# EAGLE schematic Concept_1.0_DRAFT (EAGLE 9.3.2)
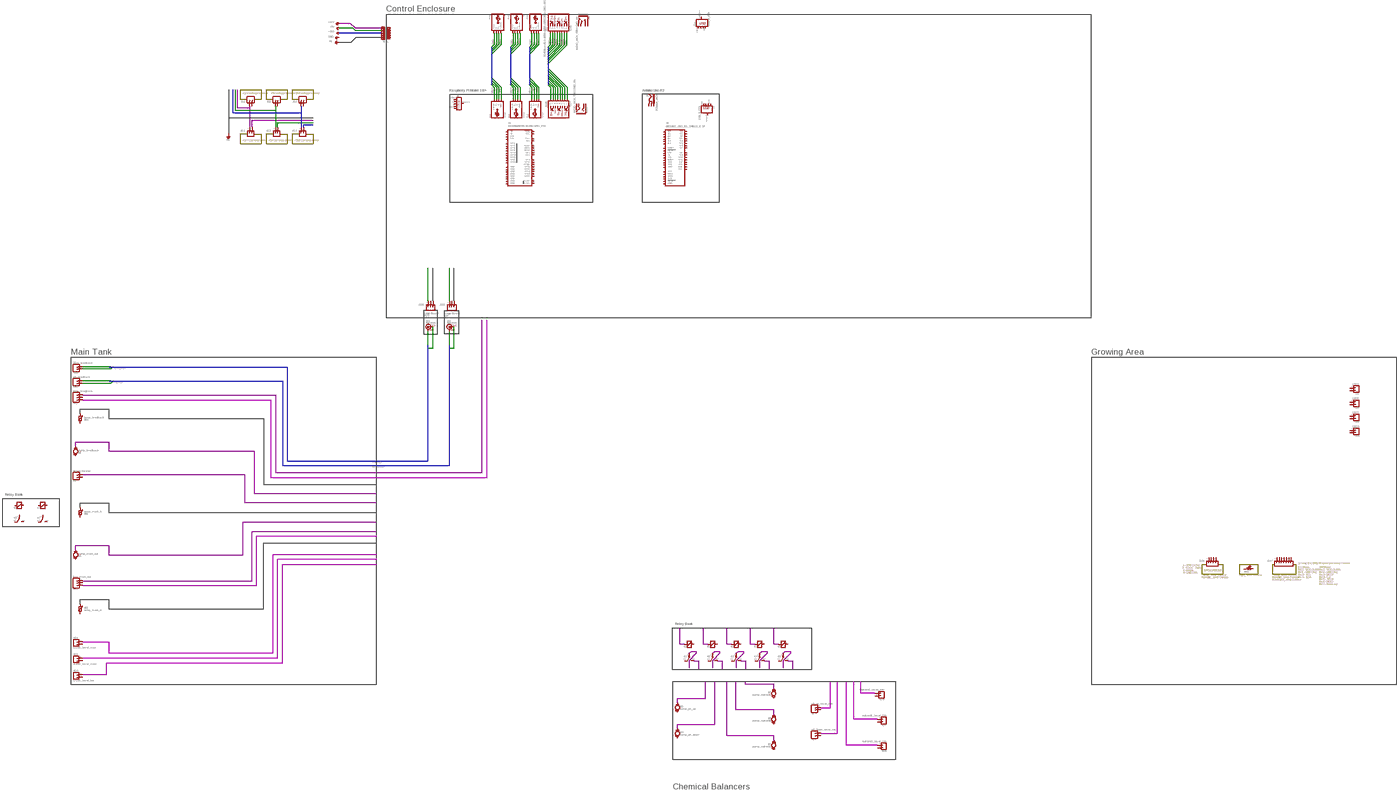
[diagram p0: schematic, sheet 1, overview]
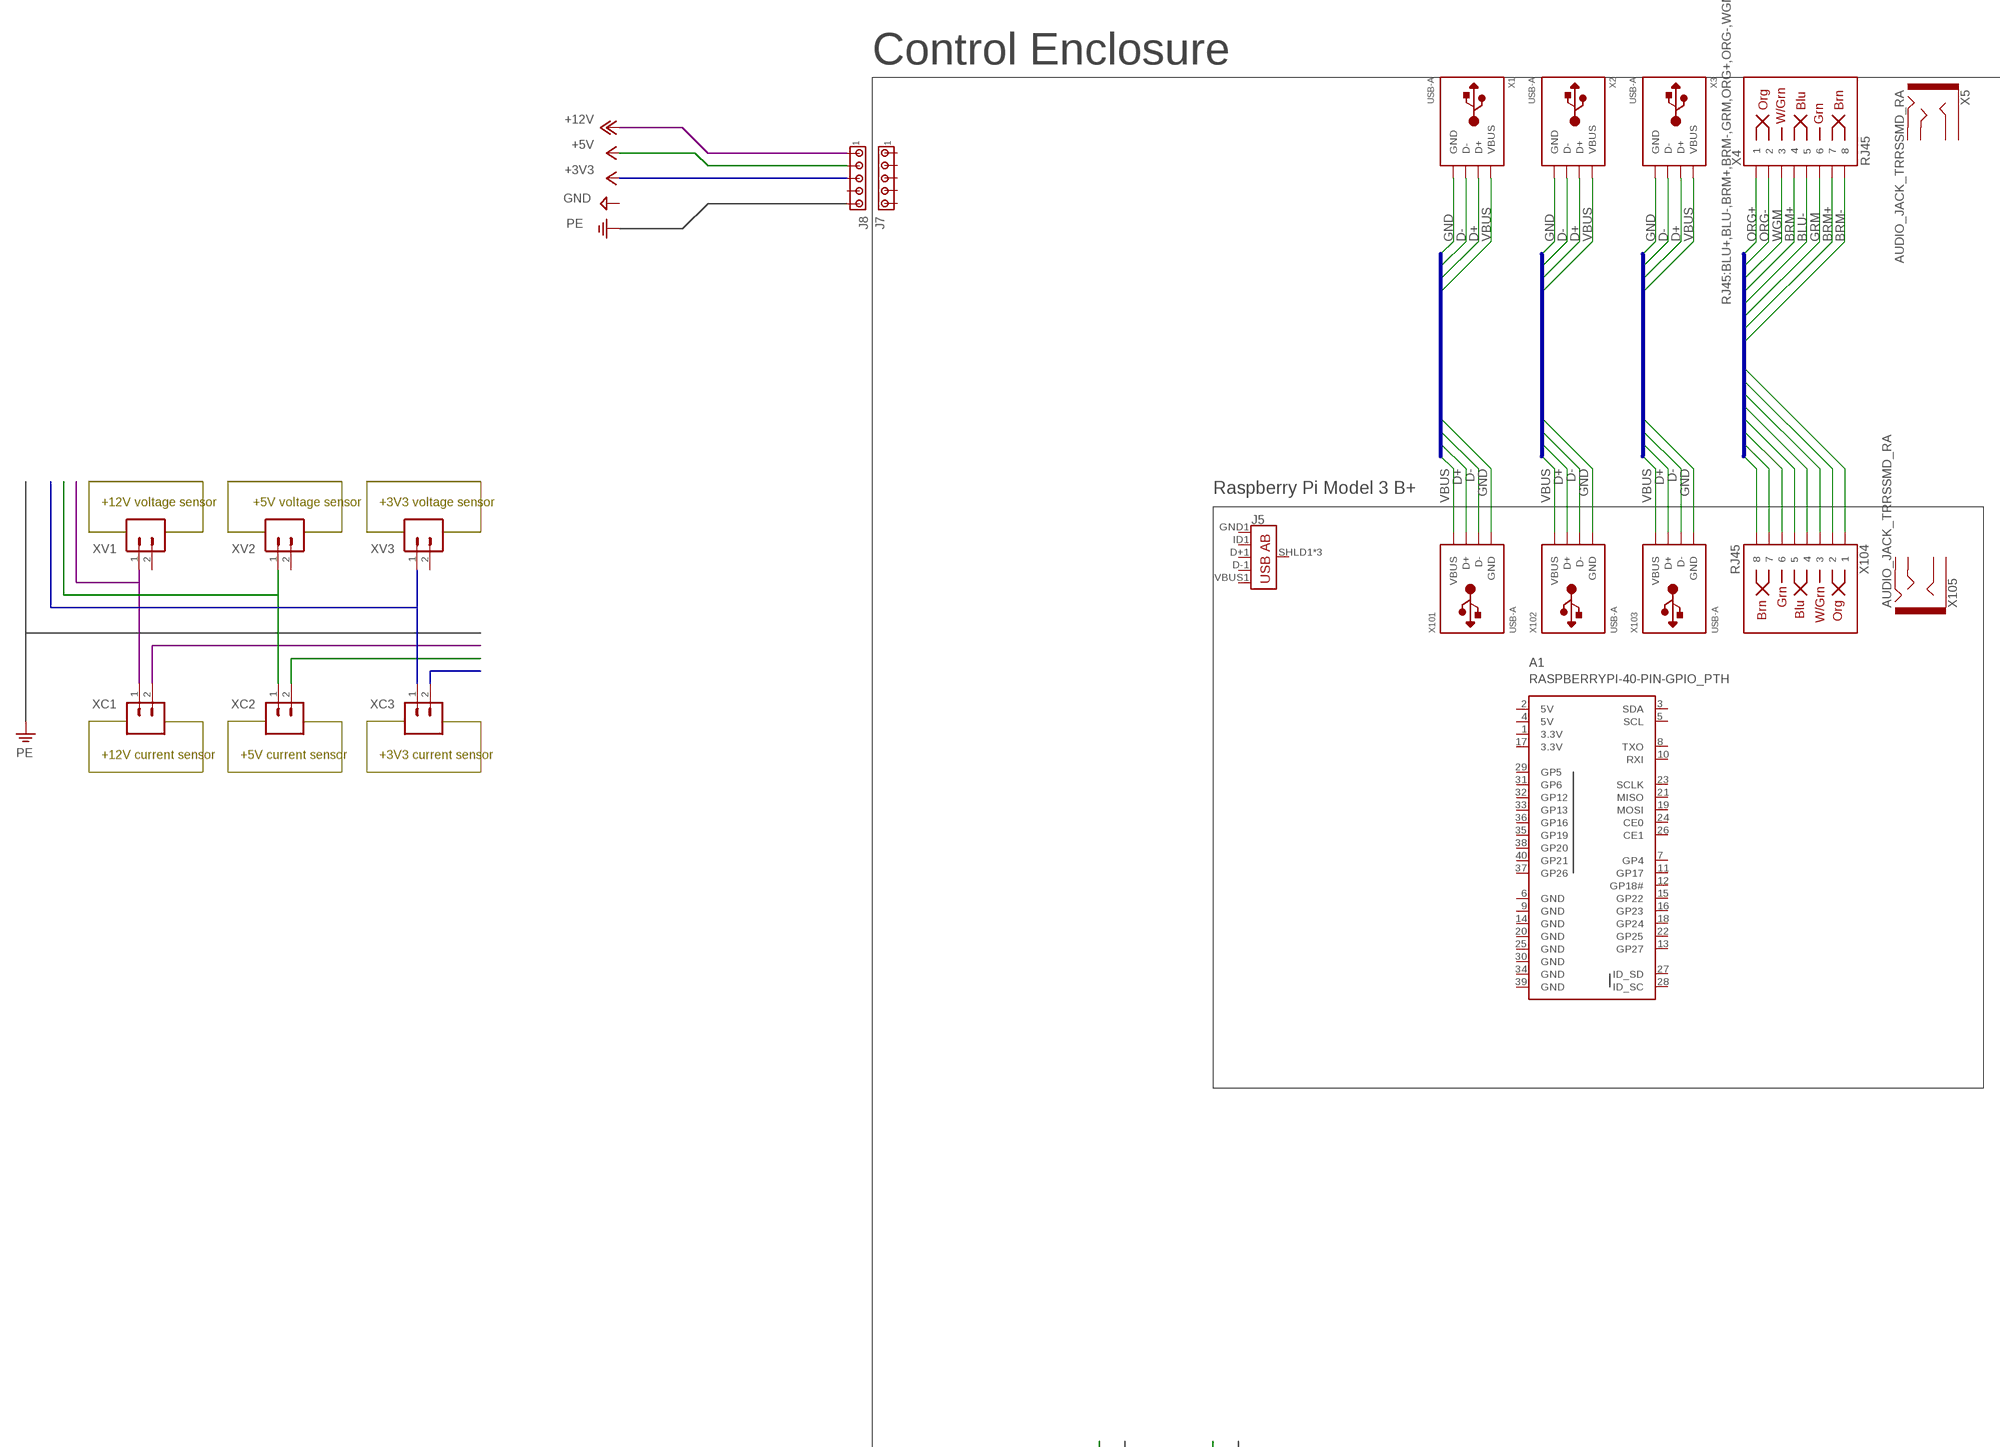
[diagram p1: schematic, sheet 1, part 1 of 7]
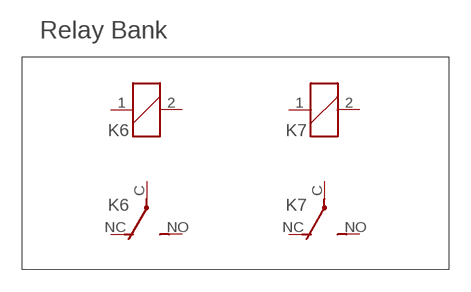
[diagram p2: schematic, sheet 1, part 2 of 7]
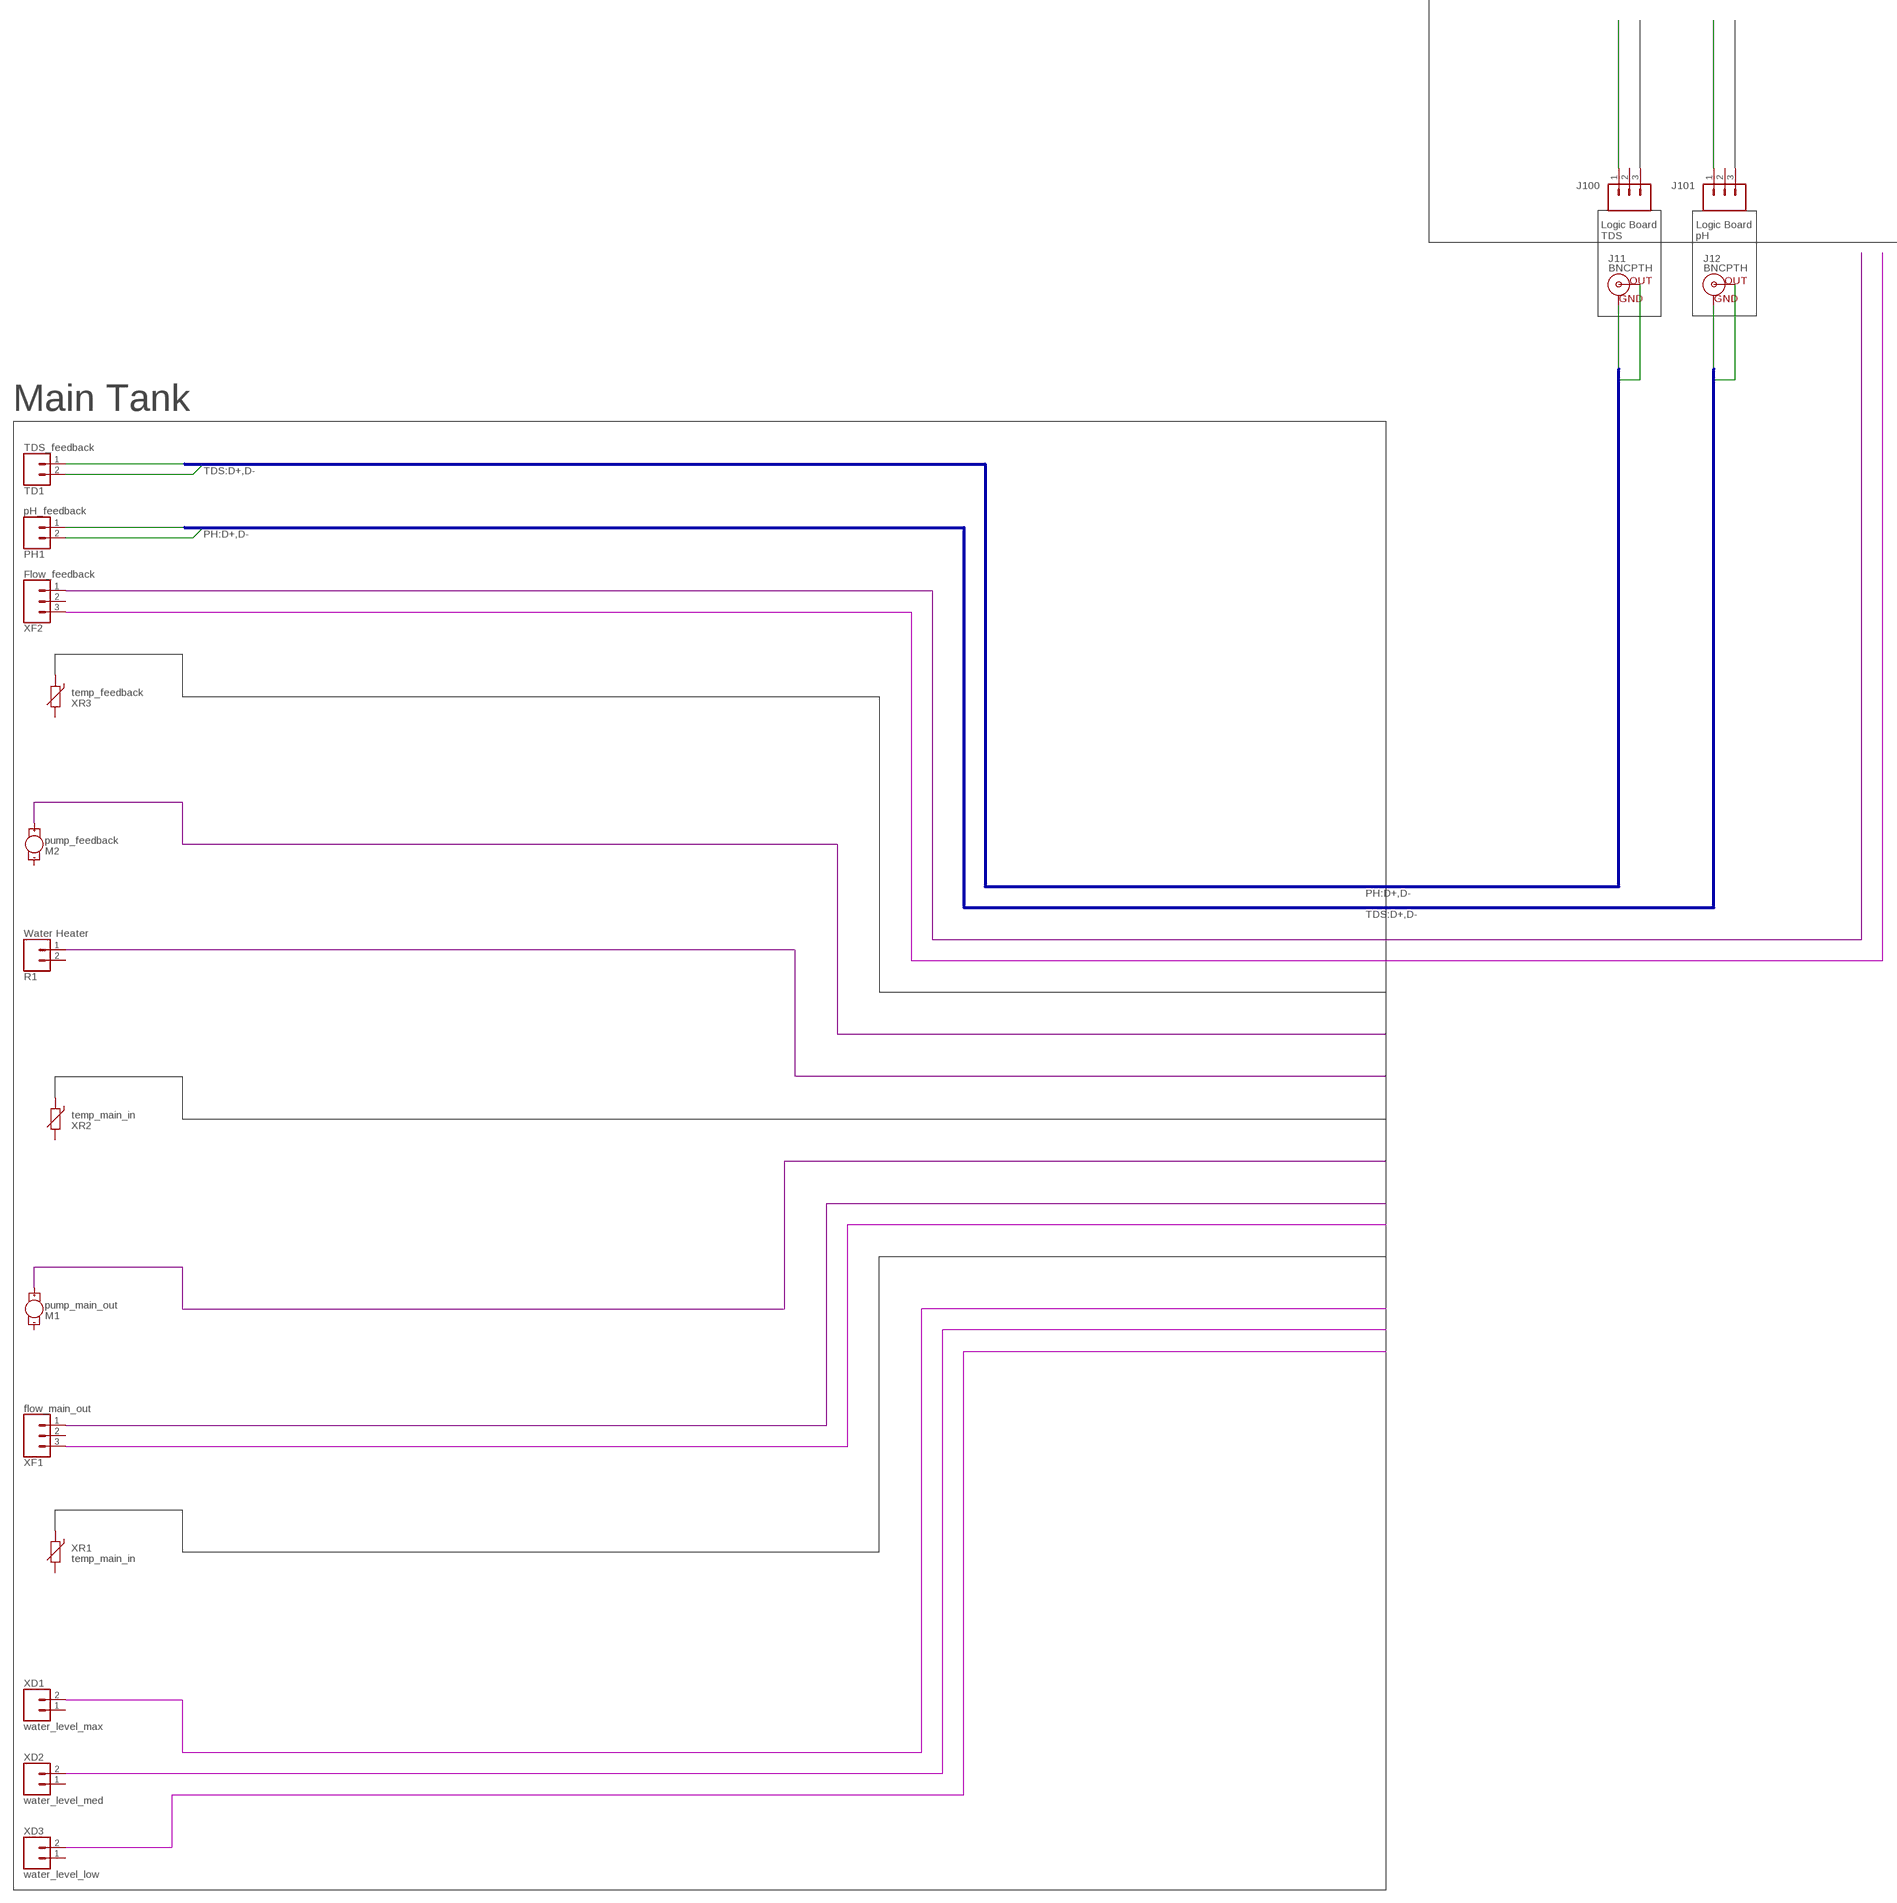
[diagram p3: schematic, sheet 1, part 3 of 7]
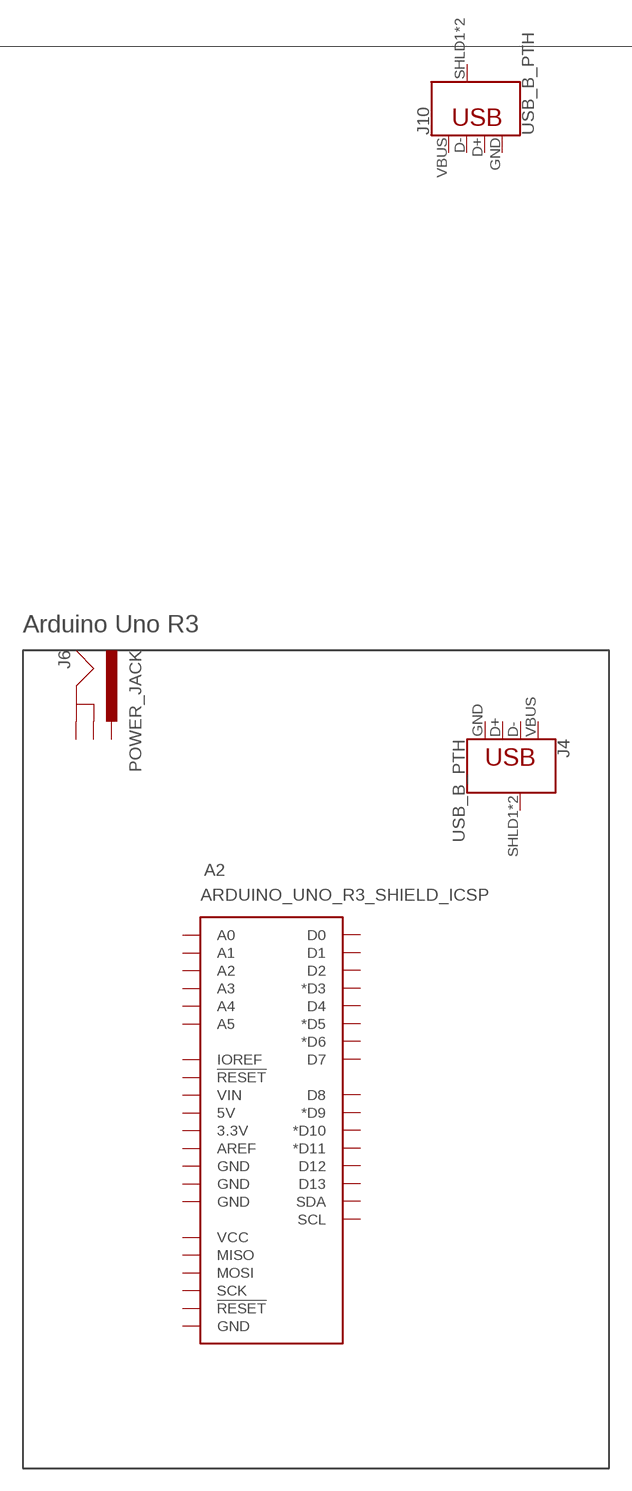
[diagram p4: schematic, sheet 1, part 4 of 7]
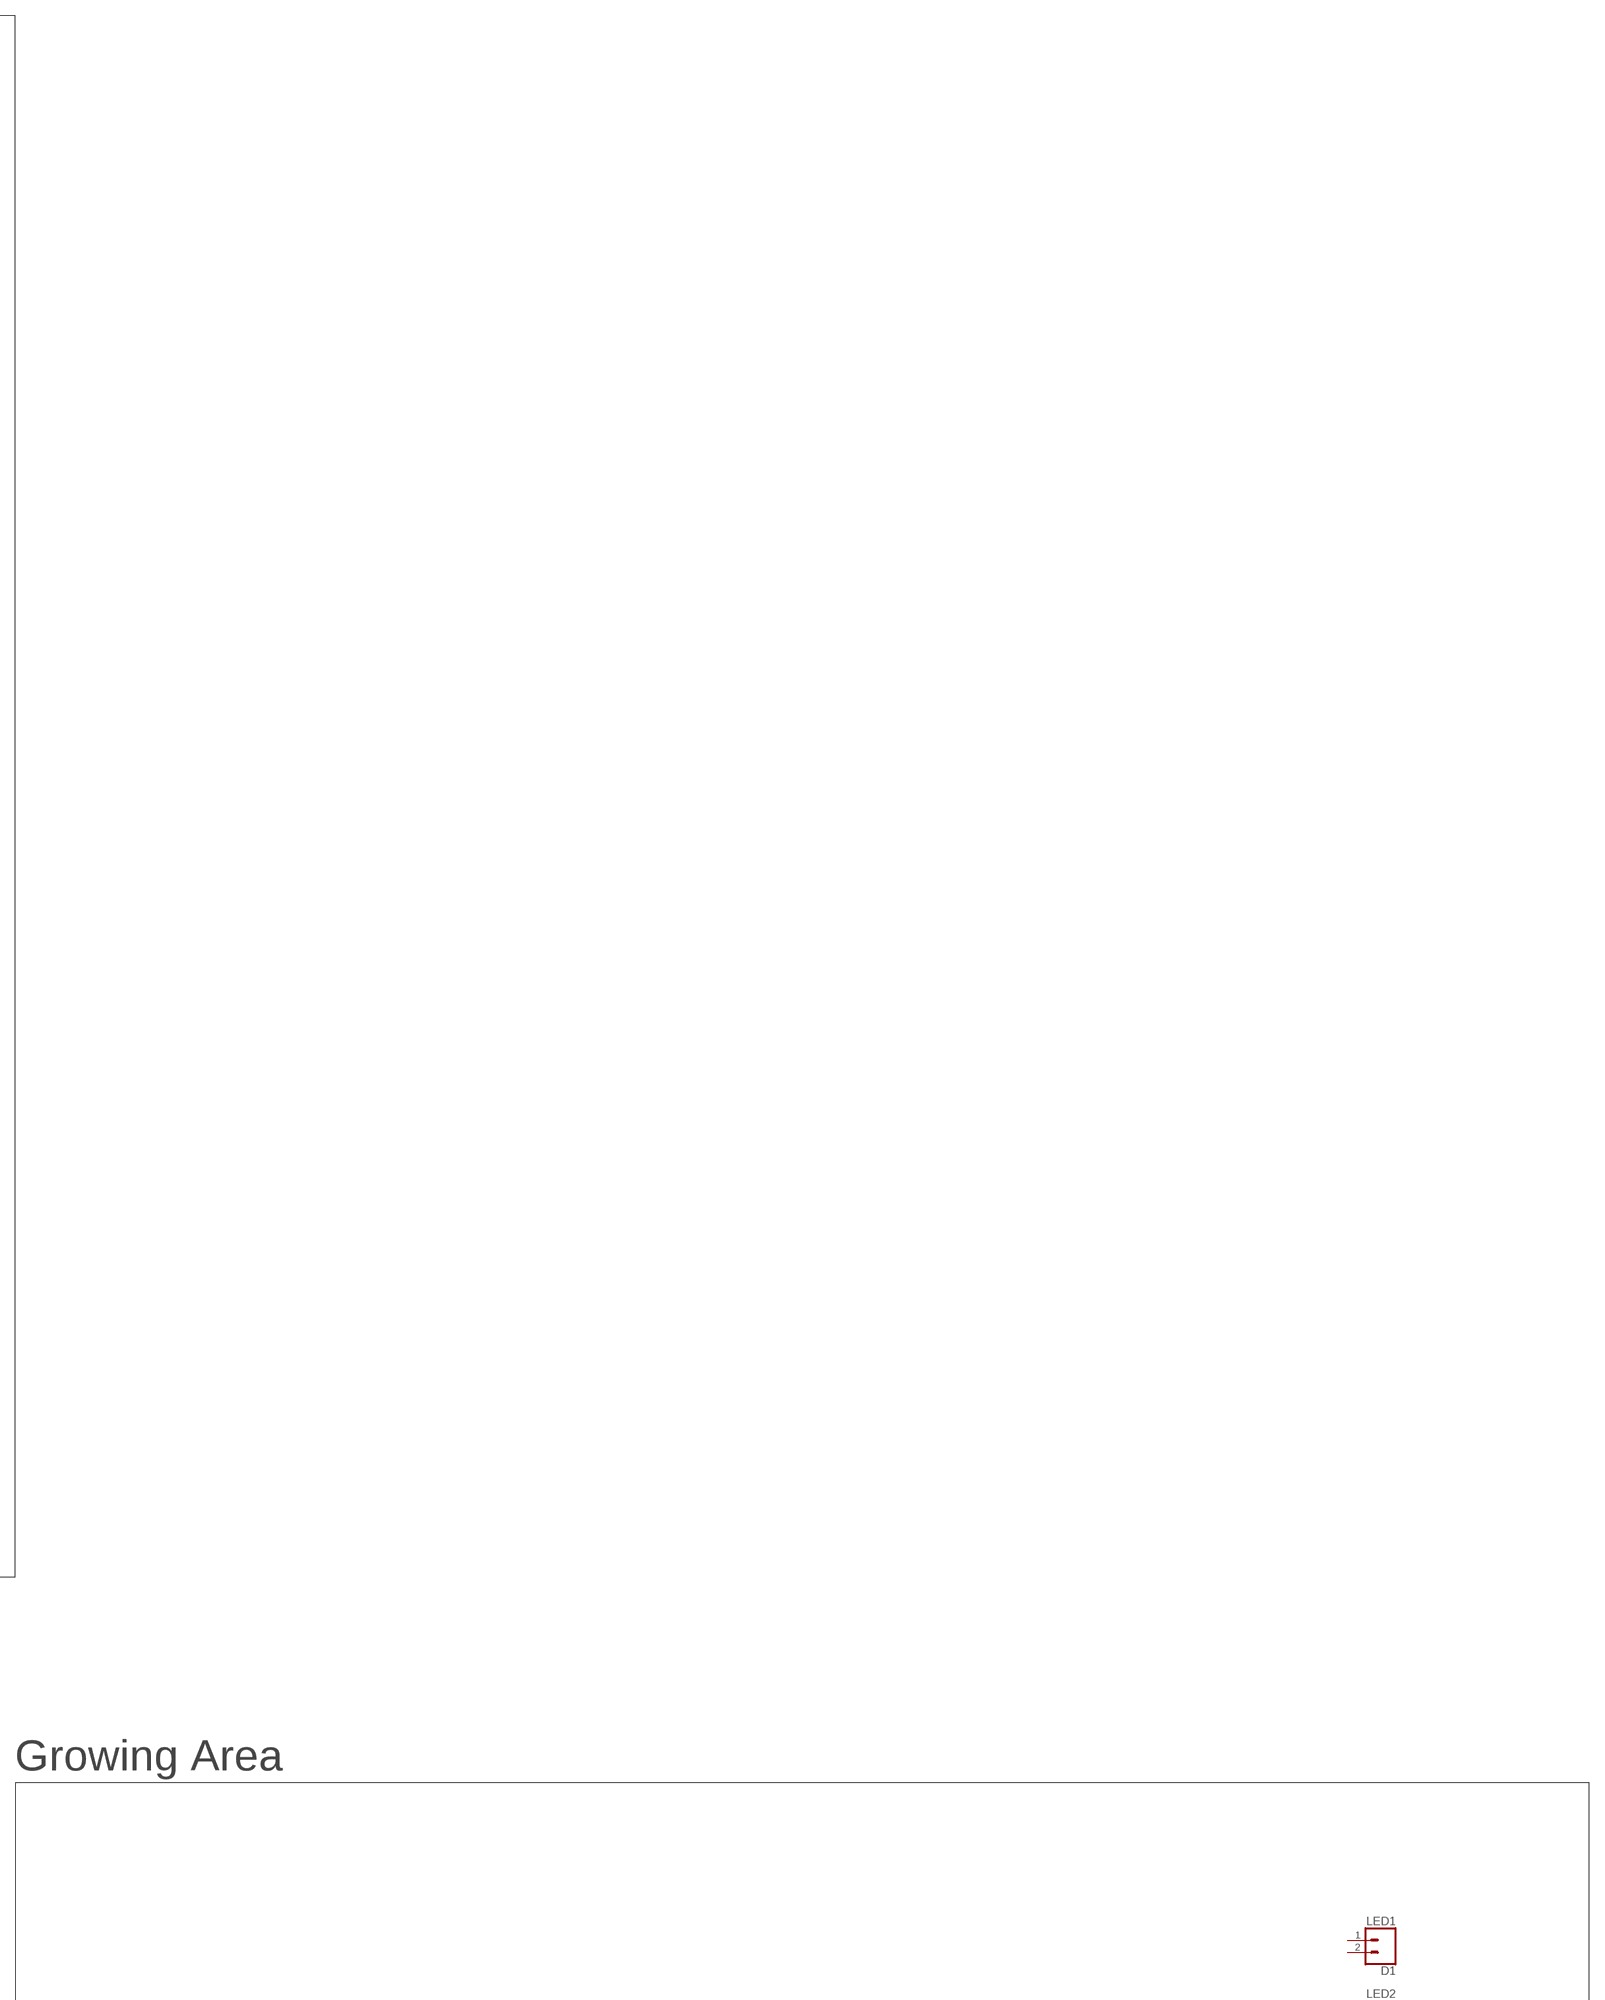
[diagram p5: schematic, sheet 1, part 5 of 7]
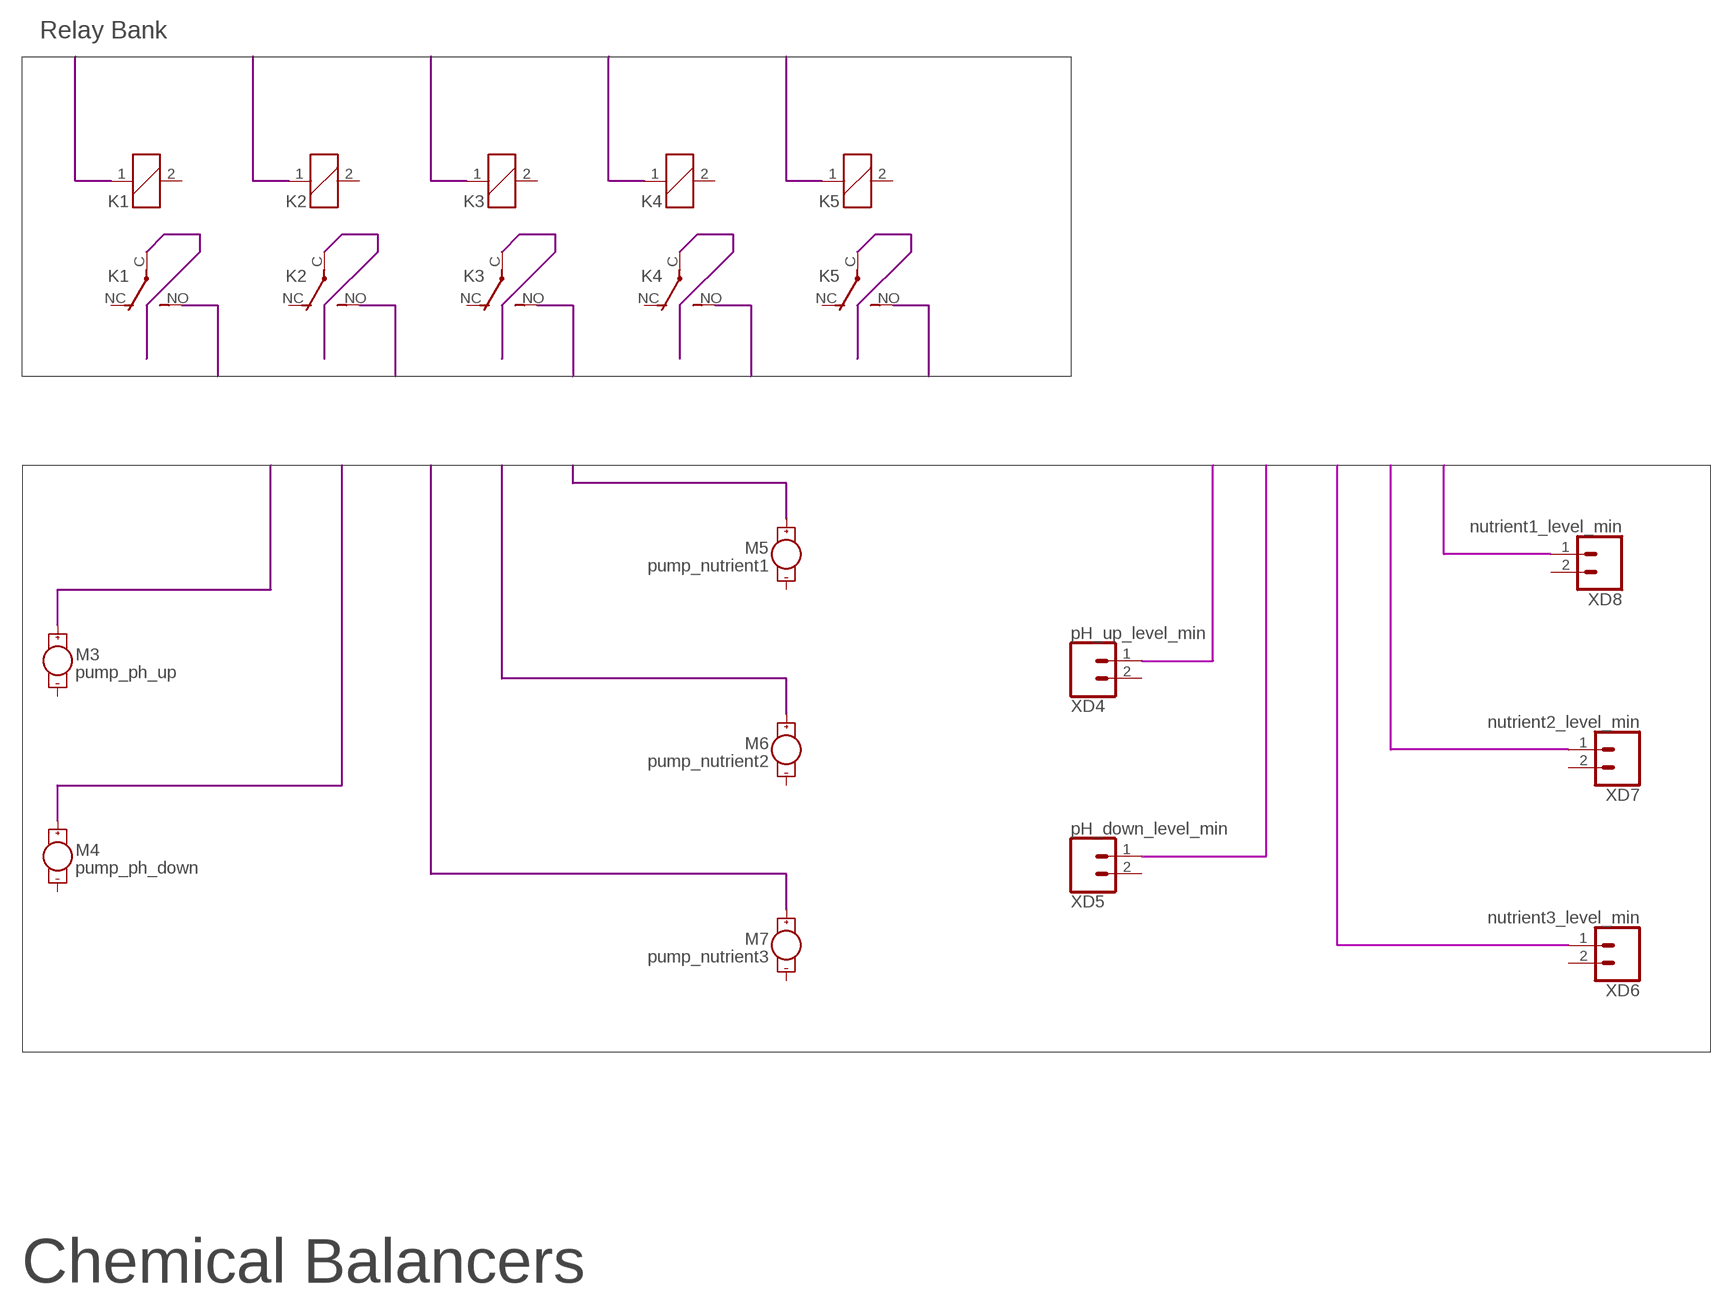
[diagram p6: schematic, sheet 1, part 6 of 7]
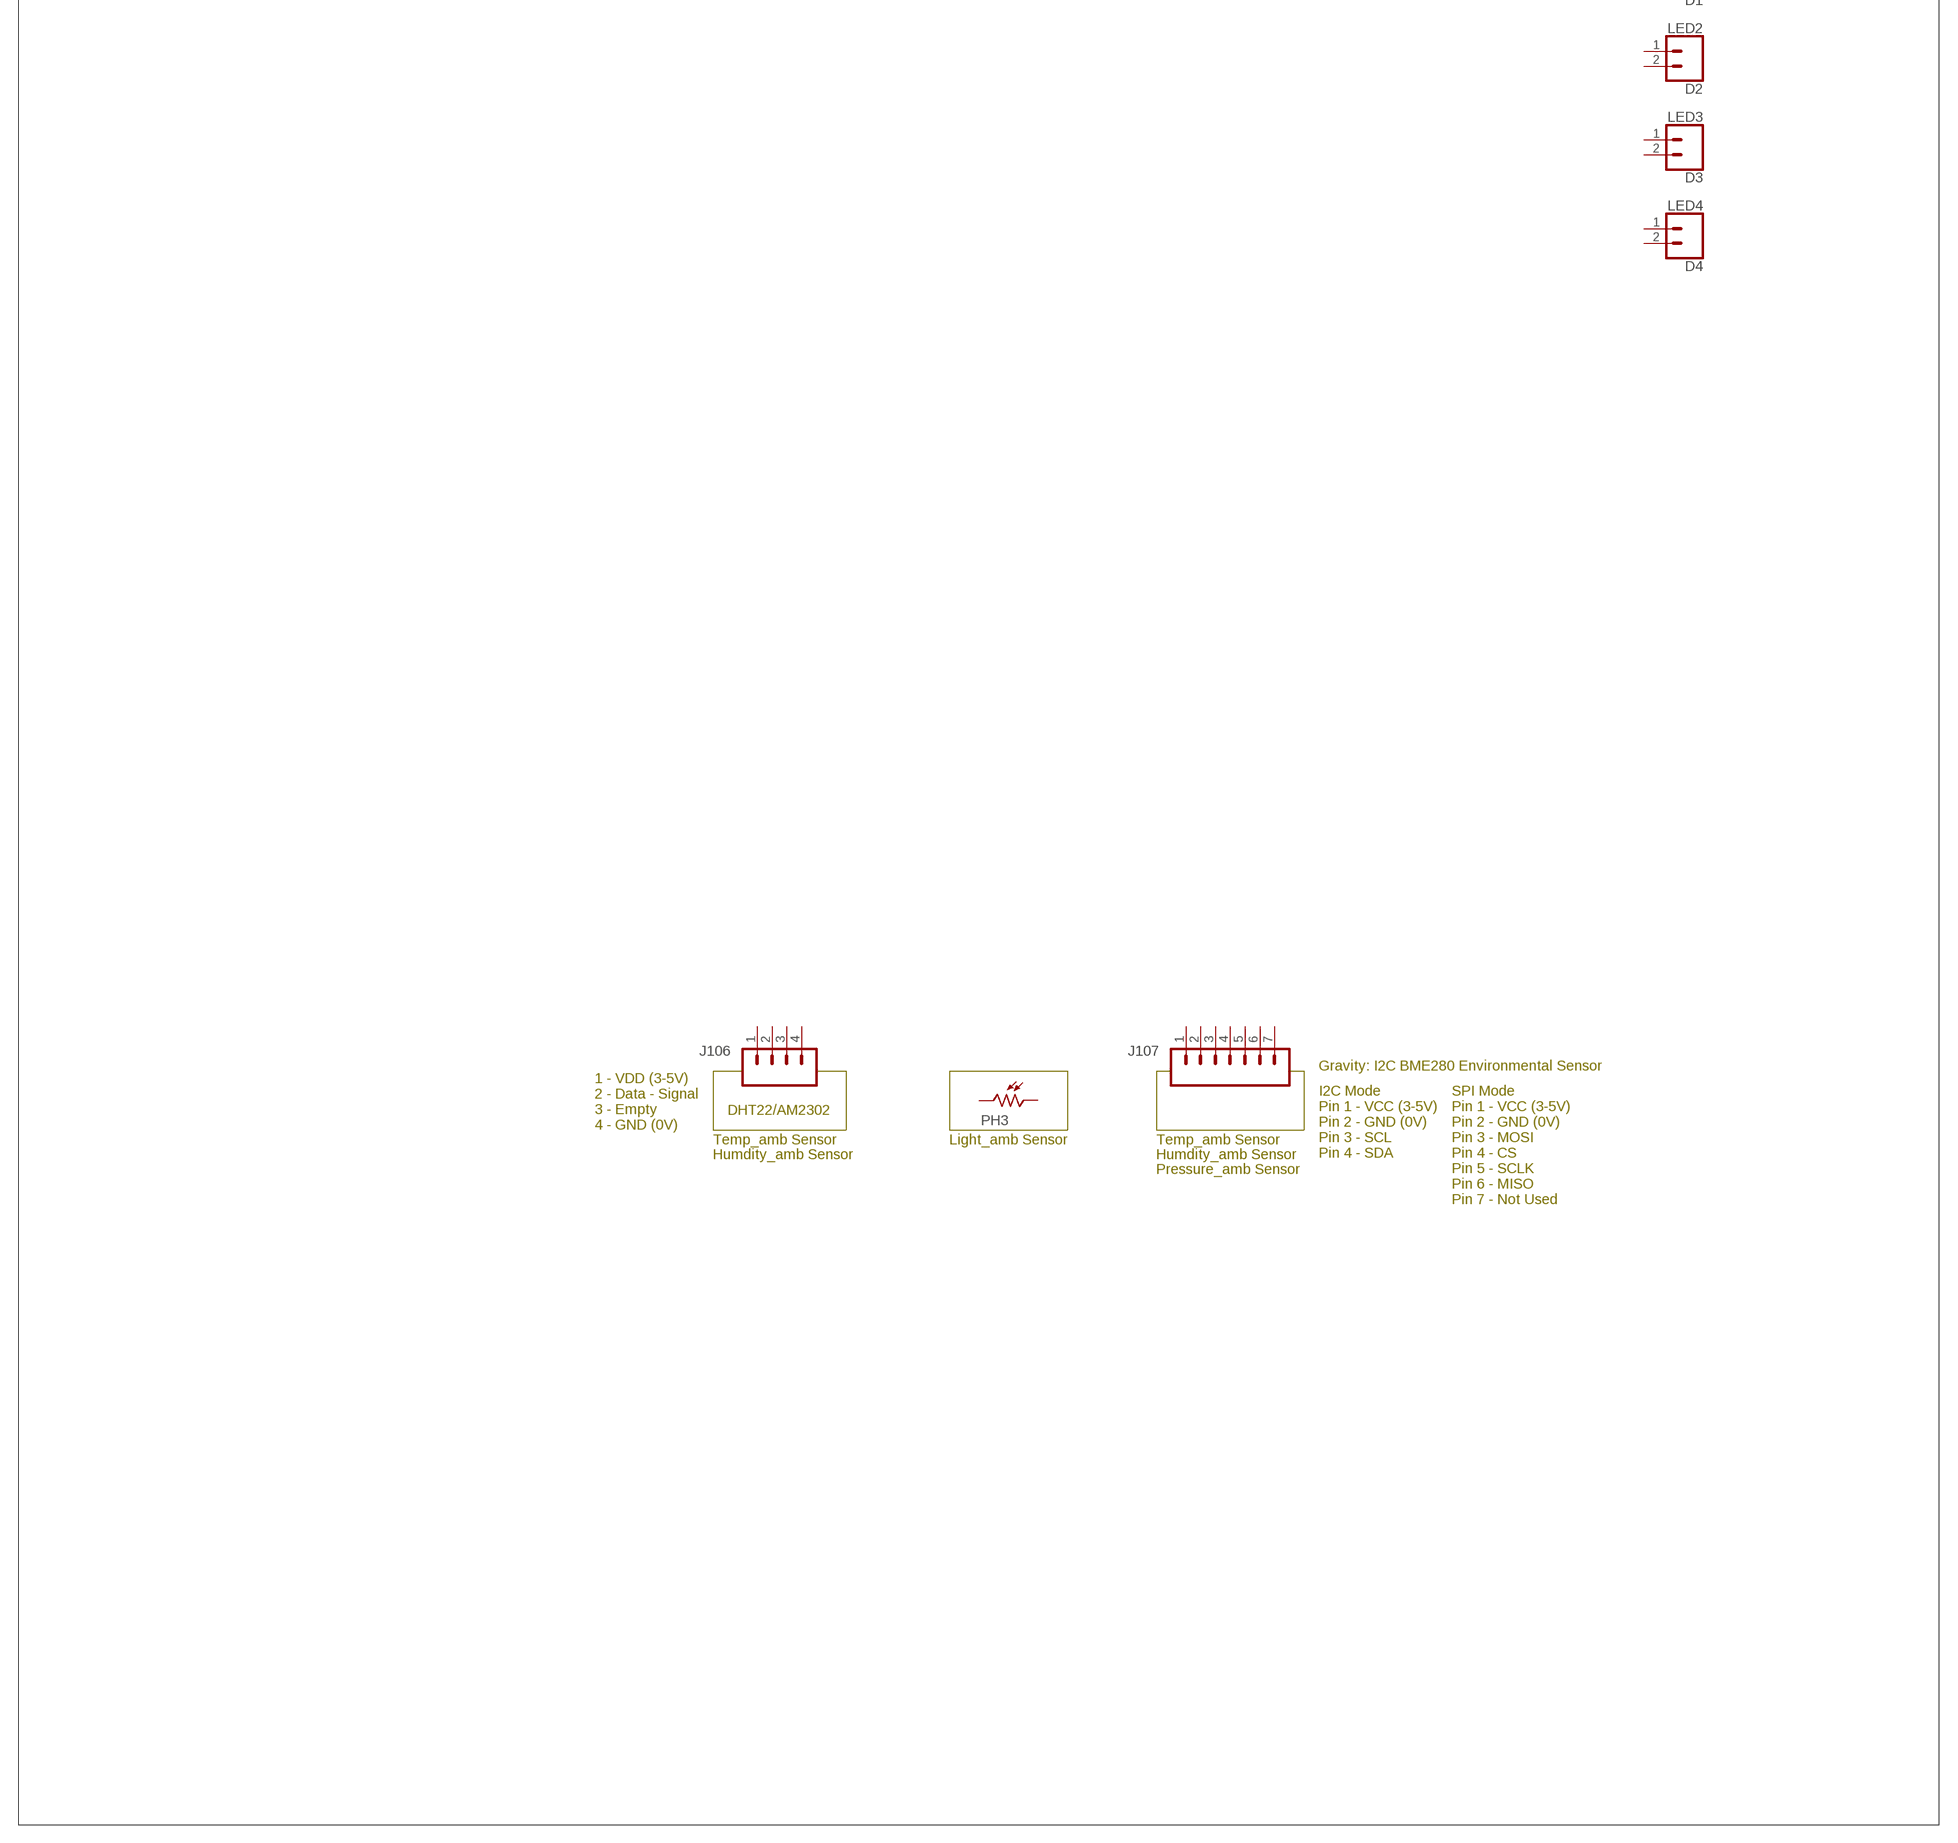
[diagram p7: schematic, sheet 1, part 7 of 7]

## Parts
A1  RASPBERRYPI-40-PIN-GPIO_PTH  [2X20_SHROUDED]
A2  ARDUINO_UNO_R3_SHIELD_ICSP  [UNO_R3_SHIELD_ICSP]
D1  LED1  CONN_02  [1X02]
D2  LED2  CONN_02  [1X02]
D3  LED3  CONN_02  [1X02]
D4  LED4  CONN_02  [1X02]
J4  USB_B_PTH  [USB-B-PTH]
J5  USB_AB_SMT  [USB-AB-MICRO-SMD]
J6  POWER_JACK  [POWER_JACK_PTH]
J7  MTA05-100  [10X05MTA]
J8  MTA05-100  [10X05MTA]
J10  USB_B_PTH  [USB-B-PTH]
J11  BNCPTH  [BNC]
J12  BNCPTH  [BNC]
J100  CONN_03  [1X03]
J101  CONN_03  [1X03]
J106  CONN_04  [1X04]
J107  CONN_07  [1X07]
K1  JJM1-12V  [JJM1C]
K2  JJM1-12V  [JJM1C]
K3  JJM1-12V  [JJM1C]
K4  JJM1-12V  [JJM1C]
K5  JJM1-12V  [JJM1C]
K6  JJM1-12V  [JJM1C]
K7  JJM1-12V  [JJM1C]
M1  pump_main_out  MOTOR10MM  [VIBE-MOTOR-10MM]
M2  pump_feedback  MOTOR10MM  [VIBE-MOTOR-10MM]
M3  pump_ph_up  MOTOR10MM  [VIBE-MOTOR-10MM]
M4  pump_ph_down  MOTOR10MM  [VIBE-MOTOR-10MM]
M5  pump_nutrient1  MOTOR10MM  [VIBE-MOTOR-10MM]
M6  pump_nutrient2  MOTOR10MM  [VIBE-MOTOR-10MM]
M7  pump_nutrient3  MOTOR10MM  [VIBE-MOTOR-10MM]
PH1  pH_feedback  CONN_02  [1X02]
PH3  B1060_23  [TO-8_B10]
R1  Water Heater  CONN_02  [1X02]
TD1  TDS_feedback  CONN_02  [1X02]
X1  USB-A  [MOLEX_480371000]
X2  USB-A  [MOLEX_480371000]
X3  USB-A  [MOLEX_480371000]
X4  RJ45  RJ45-8  [RJ45-8]
X5  AUDIO_JACK_TRRSSMD_RA  [AUDIO_JACK_3.5MM_TRRS_SMD_RA]
X101  USB-A  [MOLEX_480371000]
X102  USB-A  [MOLEX_480371000]
X103  USB-A  [MOLEX_480371000]
X104  RJ45  RJ45-8  [RJ45-8]
X105  AUDIO_JACK_TRRSSMD_RA  [AUDIO_JACK_3.5MM_TRRS_SMD_RA]
XC1  CONN_02  [1X02]
XC2  CONN_02  [1X02]
XC3  CONN_02  [1X02]
XD1  water_level_max  CONN_02  [1X02]
XD2  water_level_med  CONN_02  [1X02]
XD3  water_level_low  CONN_02  [1X02]
XD4  pH_up_level_min  CONN_02  [1X02]
XD5  pH_down_level_min  CONN_02  [1X02]
XD6  nutrient3_level_min  CONN_02  [1X02]
XD7  nutrient2_level_min  CONN_02  [1X02]
XD8  nutrient1_level_min  CONN_02  [1X02]
XF1  flow_main_out  CONN_03  [1X03]
XF2  Flow_feedback  CONN_03  [1X03]
XR1  temp_main_in  THERMISTOR-5  [R-5]
XR2  temp_main_in  THERMISTOR-5  [R-5]
XR3  temp_feedback  THERMISTOR-5  [R-5]
XV1  CONN_02  [1X02]
XV2  CONN_02  [1X02]
XV3  CONN_02  [1X02]

## Nets
+5V: J8.2
BLU-: X4.5 X104.5
BRM+: X4.4 X4.7 X104.4 X104.7
BRM-: X4.8 X104.8
D+: J11.S(OUT) J12.S(OUT) PH1.1 TD1.1 X1.3(D+) X2.3(D+) X3.3(D+) X101.3(D+) X102.3(D+) X103.3(D+)
D-: J11.GND J12.GND PH1.2 TD1.2 X1.2(D-) X2.2(D-) X3.2(D-) X101.2(D-) X102.2(D-) X103.2(D-)
GND: X1.4(GND) X2.4(GND) X3.4(GND) X101.4(GND) X102.4(GND) X103.4(GND)
GRM: X4.6 X104.6
N$1: J100.1
N$2: J101.1
N$5: XC2.1 XV2.1
N$11: XC2.2
ORG+: X4.1 X104.1
ORG-: X4.2 X104.2
VBUS: X1.1(VBUS) X2.1(VBUS) X3.1(VBUS) X101.1(VBUS) X102.1(VBUS) X103.1(VBUS)
WGM: X4.3 X104.3
Unconnected: A1.3(SDA) A1.5(SCL) A1.7(GP4) A1.8(TXO) A1.10(RXI) A1.11(GP17) A1.12(GP18#) A1.13(GP27) A1.15(GP22) A1.16(GP23) A1.18(GP24) A1.19(MOSI) A1.21(MISO) A1.22(GP25) A1.23(SCLK) A1.24(CE0) A1.26(CE1) A1.27(ID_SD) A1.28(ID_SC) A1.29(GP5) A1.31(GP6) A1.32(GP12) A1.33(GP13) A1.35(GP19) A1.36(GP16) A1.37(GP26) A1.38(GP20) A1.40(GP21) A2.3.3V A2.5V A2.5V_ICSP(VCC) A2.A0 A2.A1 A2.A2 A2.A3 A2.A4 A2.A5 A2.AREF A2.D2 A2.D3(*D3) A2.D4 A2.D5(*D5) A2.D6(*D6) A2.D7 A2.D8 A2.D9(*D9) A2.D10(*D10) A2.D11(*D11) A2.D12 A2.D13 A2.GND@0(GND) A2.GND@1(GND) A2.GND@2(GND) A2.GND_ICSP(GND) A2.IOREF A2.MISO A2.MOSI A2.RES(!RESET!) A2.RST_ICSP(!RESET!) A2.RX(D0) A2.SCK A2.SCL A2.SDA A2.TX(D1) A2.VIN D1.1 D1.2 D2.1 D2.2 D3.1 D3.2 D4.1 D4.2 J4.D+ J4.D- J4.SHLD1(SHIELD) J4.SHLD2(SHIELD) J5.D+1(D+) J5.D-1(D-) J5.ID1(USBID) J5.SHLD1(SHIELD) J5.SHLD2(SHIELD) J5.SHLD3(SHIELD) J6.GND J6.GNDBREAK J6.PWR J7.1 J7.2 J7.3 J7.4 J7.5 J8.1 J8.3 J8.4 J8.5 J10.D+ J10.D- J10.SHLD1(SHIELD) J10.SHLD2(SHIELD) J100.2 J100.3 J101.2 J101.3 J106.1 J106.2 J106.3 J106.4 J107.1 J107.2 J107.3 J107.4 J107.5 J107.6 J107.7 K1.1 K1.2 K1.C(2:P) K1.NC(2:O) K1.NO(2:S) K2.1 K2.2 K2.C(2:P) K2.NC(2:O) K2.NO(2:S) K3.1 K3.2 K3.C(2:P) K3.NC(2:O) K3.NO(2:S) K4.1 K4.2 K4.C(2:P) K4.NC(2:O) K4.NO(2:S) K5.1 K5.2 K5.C(2:P) K5.NC(2:O) K5.NO(2:S) K6.1 K6.2 K6.C(2:P) K6.NC(2:O) K6.NO(2:S) K7.1 K7.2 K7.C(2:P) K7.NC(2:O) K7.NO(2:S) M1.+ M1.- M2.+ M2.- M3.+ M3.- M4.+ M4.- M5.+ M5.- M6.+ M6.- M7.+ M7.- PH3.1 PH3.2 R1.1 R1.2 X5.EARTH X5.RING1 X5.RING2 X5.TIP X105.EARTH X105.RING1 X105.RING2 X105.TIP XC1.1 XC1.2 XC3.1 XC3.2 XD1.1 XD1.2 XD2.1 XD2.2 XD3.1 XD3.2 XD4.1 XD4.2 XD5.1 XD5.2 XD6.1 XD6.2 XD7.1 XD7.2 XD8.1 XD8.2 XF1.1 XF1.2 XF1.3 XF2.1 XF2.2 XF2.3 XR1.1 XR1.2 XR2.1 XR2.2 XR3.1 XR3.2 XV1.1 XV1.2 XV2.2 XV3.1 XV3.2

## Buses
B$2
B$3
B$1
USB:D-,D+,GND,VBUS
RJ45:BLU+,BLU-,BRM+,BRM-,GRM,ORG+,ORG-,WGM
TDS:D+,D-
PH:D+,D-

## Notes on the sheet
- Control Enclosure
- Raspberry Pi Model 3 B+ | Arduino Uno R3
- +12V voltage sensor | +5V voltage sensor | +3V3 voltage sensor
- +12V current sensor | +5V current sensor | +3V3 current sensor
- Logic Board
   TDS
- Logic Board
   pH
- Main Tank | Growing Area
- Relay Bank
- Gravity: I2C BME280 Environmental Sensor
- I2C Mode
  Pin 1 - VCC (3-5V)
  Pin 2 - GND (0V)
  Pin 3 - SCL
  Pin 4 - SDA
- SPI Mode
  Pin 1 - VCC (3-5V)
  Pin 2 - GND (0V)
  Pin 3 - MOSI
  Pin 4 - CS
  Pin 5 - SCLK
  Pin 6 - MISO
  Pin 7 - Not Used
- DHT22/AM2302
- 1 - VDD (3-5V)
  2 - Data - Signal
  3 - Empty
  4 - GND (0V)
- Temp_amb Sensor | Light_amb Sensor | Temp_amb Sensor
- Humdity_amb Sensor | Humdity_amb Sensor
- Pressure_amb Sensor
- Relay Bank
- Chemical Balancers

## Power pins joined to a net without a drawn wire
3.3V: A1.1(3.3V) A1.17(3.3V)
5V: A1.2(5V) A1.4(5V)
GND: A1.6(GND) A1.9(GND) A1.14(GND) A1.20(GND) A1.25(GND) A1.30(GND) A1.34(GND) A1.39(GND) J4.GND J5.GND1(GND) J10.GND
VBUS: J4.VBUS J5.VBUS1(VBUS) J10.VBUS

## Library data of the parts
A1 = SparkFun-Connectors:RASPBERRYPI-40-PIN-GPIO: Raspberry Pi GPIO Header 2x20 pin connector, as found on B, B+, A+ models. Both shrouded PTH and SMT versions available. SparkFun Products: GPIO Shrouded Header <https://www.sparkfun.com/products/13054>- PTH SparkFun Pi Wedge (Preassembled) <https://www.sparkfun.com/products/13717>; PROD_ID: CONN-12263; SF_ID: PRT-13054
A2 = SparkFun-Boards:ARDUINO_UNO_R3_SHIELD_ICSP: Arduino R3 Shield Footprint with ICSP Header Includes pins for 6-pin (2x3) ICSP Header. Compatible with Leonardo boards that require SPI pin connections via this header. SparkFun Products: CryptoShield <https://www.sparkfun.com/products/13183> microSD Shield <https://www.sparkfun.com/products/12761> R3 Stackable Headers Kit <https://www.sparkfun.com/products/1417>
D1-D4 PH1 R1 TD1 XC1-XC3 XD1-XD8 XV1-XV3 = SparkFun-Connectors:CONN_02: Multi connection point. Often used as Generic Header-pin footprint for 0.1 inch spaced/style header connections On any of the 0.1 inch spaced packages, you can populate with these: Break Away Headers - Straight <https://www.sparkfun.com/products/116> (PRT-00116) Break Away Male Headers - Right Angle <https://www.sparkfun.com/products/553> (PRT-00553) Female Headers <https://www.sparkfun.com/products/115> (PRT-00115) Break Away Headers - Machine Pin <https://www.sparkfun.com/products/117> (PRT-00117) Break Away Female Headers - Swiss Machine Pin <https://www.sparkfun.com/products/743> (PRT-00743) For SCREWTERMINALS and SPRING TERMINALS visit here: Screw Terimnals on SparkFun.com <https://www.sparkfun.com/search/results?term=Screw+Terminals> (5mm/3.5mm/2.54mm spacing) This device is also useful as a general connection point to wire up your design to another part of your project. Our various solder wires solder well into these plated through hole pads. Hook-Up Wire - Assortment (Stranded, 22 AWG) <https://www.sparkfun.com/products/11375> (PRT-11375) Hook-Up Wire - Assortment (Solid Core, 22 AWG) <https://www.sparkfun.com/products/11367> (PRT-11367) View the entire wire category on our website here <https://www.sparkfun.com/categories/141> Special notes: Molex polarized connector foot print use with: PRT-08233 with associated crimp pins and housings. 2.54_SCREWTERM for use with PRT-10571. 3.5mm Screw Terminal footprints for PRT-08084 5mm Screw Terminal footprints for use with PRT-08432
J4 J10 = SparkFun-Connectors:USB_B: USB Type B Connector SparkFun Products: SparkFun Stepoko <https://www.sparkfun.com/products/13899> PTH; PROD_ID: CONN-08278; SF_ID: PRT-00139
J5 = SparkFun-Connectors:USB_AB: USB Type AB Micro Connector OTG-compatible. 5 pins, 3 shield pins SparkFun Products: IOIO-OTG <https://www.sparkfun.com/products/13613> SparkFun SAMD21 Mini Breakout <https://www.sparkfun.com/products/13664>; PROD_ID: CONN-11794
J6 = SparkFun-Connectors:POWER_JACK: Power Jack Connector This is the standard 5.5mm barrel jack for power. The PTH is the most common, proven, reliable, footprint. The Slot footprint only works if the mill layer is transmitted to the PCB fab house so be warned. Here are the connectors we sell at SparkFun: DC Barrel Power Jack/Connector <https://www.sparkfun.com/products/119> (PRT-00119) DC Barrel Power Jack/Connector (SMD) <https://www.sparkfun.com/products/12748> (PRT-12748) DC Barrel Jack Adapter - Breadboard Compatible <https://www.sparkfun.com/products/10811> (PRT-10811) It is used on this SparkFun product (and many, many others): SparkFun RedBoard - Programmed with Arduino <https://www.sparkfun.com/products/12757> (DEV-12757) Also, if you need a mating power supply or connector, please check these out: Wall Adapter Power Supply - 9VDC 650mA <https://www.sparkfun.com/products/298> (TOL-00298) DC Barrel Jack Adapter - Male <https://www.sparkfun.com/products/10287> (PRT-10287); PROD_ID: CONN-08197
J7 J8 = con-amp:MTA05-100: AMP connector
J11 J12 = SparkFun-Connectors:BNC: BNC Right Angle Connector Mouser Part# 5227161 SparkFun Products: BNC Connector - Right Angle <https://www.sparkfun.com/products/10550>; PROD_ID: LPA-12729; SF_ID: PRT-10550
J100 J101 XF1 XF2 = SparkFun-Connectors:CONN_03: Multi connection point. Often used as Generic Header-pin footprint for 0.1 inch spaced/style header connections On any of the 0.1 inch spaced packages, you can populate with these: Break Away Headers - Straight <https://www.sparkfun.com/products/116> (PRT-00116) Break Away Male Headers - Right Angle <https://www.sparkfun.com/products/553> (PRT-00553) Female Headers <https://www.sparkfun.com/products/115> (PRT-00115) Break Away Headers - Machine Pin <https://www.sparkfun.com/products/117> (PRT-00117) Break Away Female Headers - Swiss Machine Pin <https://www.sparkfun.com/products/743> (PRT-00743) Stackable Header - 3 Pin (Female, 0.1") <https://www.sparkfun.com/products/13875> (PRT-13875) For SCREWTERMINALS and SPRING TERMINALS visit here: Screw Terimnals on SparkFun.com <https://www.sparkfun.com/search/results?term=Screw+Terminals> (5mm/3.5mm/2.54mm spacing) This device is also useful as a general connection point to wire up your design to another part of your project. Our various solder wires solder well into these plated through hole pads. Hook-Up Wire - Assortment (Stranded, 22 AWG) <https://www.sparkfun.com/products/11375> (PRT-11375) Hook-Up Wire - Assortment (Solid Core, 22 AWG) <https://www.sparkfun.com/products/11367> (PRT-11367) View the entire wire category on our website here <https://www.sparkfun.com/categories/141> Special notes: Molex polarized connector foot print use with SKU : PRT-08232 with associated crimp pins and housings.
J106 = SparkFun-Connectors:CONN_04: Multi connection point. Often used as Generic Header-pin footprint for 0.1 inch spaced/style header connections On any of the 0.1 inch spaced packages, you can populate with these: Break Away Headers - Straight <https://www.sparkfun.com/products/116> (PRT-00116) Break Away Male Headers - Right Angle <https://www.sparkfun.com/products/553> (PRT-00553) Female Headers <https://www.sparkfun.com/products/115> (PRT-00115) Break Away Headers - Machine Pin <https://www.sparkfun.com/products/117> (PRT-00117) Break Away Female Headers - Swiss Machine Pin <https://www.sparkfun.com/products/743> (PRT-00743) For SCREWTERMINALS and SPRING TERMINALS visit here: Screw Terimnals on SparkFun.com <https://www.sparkfun.com/search/results?term=Screw+Terminals> (5mm/3.5mm/2.54mm spacing) This device is also useful as a general connection point to wire up your design to another part of your project. Our various solder wires solder well into these plated through hole pads. Hook-Up Wire - Assortment (Stranded, 22 AWG) <https://www.sparkfun.com/products/11375> (PRT-11375) Hook-Up Wire - Assortment (Solid Core, 22 AWG) <https://www.sparkfun.com/products/11367> (PRT-11367) View the entire wire category on our website here <https://www.sparkfun.com/categories/141> Special notes: Molex polarized connector foot print use with SKU : PRT-08231 with associated crimp pins and housings. 1MM SMD Version SKU: PRT-10208; PROD_ID: CONN-09696
J107 = SparkFun-Connectors:CONN_07: Multi connection point. Often used as Generic Header-pin footprint for 0.1 inch spaced/style header connections On any of the 0.1 inch spaced packages, you can populate with these: Break Away Headers - Straight <https://www.sparkfun.com/products/116> (PRT-00116) Break Away Male Headers - Right Angle <https://www.sparkfun.com/products/553> (PRT-00553) Female Headers <https://www.sparkfun.com/products/115> (PRT-00115) Break Away Headers - Machine Pin <https://www.sparkfun.com/products/117> (PRT-00117) Break Away Female Headers - Swiss Machine Pin <https://www.sparkfun.com/products/743> (PRT-00743) For SCREWTERMINALS and SPRING TERMINALS visit here: Screw Terimnals on SparkFun.com <https://www.sparkfun.com/search/results?term=Screw+Terminals> (5mm/3.5mm/2.54mm spacing) This device is also useful as a general connection point to wire up your design to another part of your project. Our various solder wires solder well into these plated through hole pads. Hook-Up Wire - Assortment (Stranded, 22 AWG) <https://www.sparkfun.com/products/11375> (PRT-11375) Hook-Up Wire - Assortment (Solid Core, 22 AWG) <https://www.sparkfun.com/products/11367> (PRT-11367) View the entire wire category on our website here <https://www.sparkfun.com/categories/141> Special notes: Molex polarized connector foot print use with SKU : PRT-08231 with associated crimp pins and housings. 1MM SMD Version SKU: PRT-10208 NOTES ON THE VARIANTS LOCK and LOCK_LONGPADS... This footprint was designed to help hold the alignment of a through-hole component (i.e. 6-pin header) while soldering it into place. You may notice that each hole has been shifted either up or down by 0.005 of an inch from it's more standard position (which is a perfectly straight line). This slight alteration caused the pins (the squares in the middle) to touch the edges of the holes. Because they are alternating, it causes a "brace" to hold the component in place. 0.005 has proven to be the perfect amount of "off-center" position when using our standard breakaway headers. Although looks a little odd when you look at the bare footprint, once you have a header in there, the alteration is very hard to notice. Also,if you push a header all the way into place, it is covered up entirely on the bottom side.
K1-K7 = relay:JJM1-12V: HALF-SIZE AUTOMOTIVE RELAY NAiS Source: http://www.mew-europe.com/.. en_ds_61210_0001.pdf; MF: AROMAT/ MATSUSHITA; MPN: JJM1-12V; OC_FARNELL: unknown; OC_NEWARK: 10C7318
M1-M7 = SparkFun-Electromechanical:MOTOR: Motor (Single-Phase) Two-terminal, single-phase motors. SparkFun Products Vibration Motor <https://www.sparkfun.com/products/8449> (ROB-08449) Physical dimension and wire connections for this powerful vibration motor. Motor has a self adhesive backing.; PROD_ID: COMP-08572; SF_SKU: ROB-08449
PH3 = photo-elements:?1060*: Sensor Street Light control Source: http://optoelectronics.perkinelmer.com/content/Datasheets/DTS_PhotocellsB1060.pdf
X1-X3 X101-X103 = adafruit:USB-A: USB type A 'plug' Used for things that can directly connect to a USB port, say USB key
X4 X104 = SparkFun-Connectors:RJ45-8: RJ45 Jack - 8 pin Simple RJ45, 8-pin connection. Commonly used for Cat5, Cat5e, and Cat6 Ethernet cables. Here is the connector we sell at SparkFun: RJ45 8-Pin Connector <https://www.sparkfun.com/products/643> (PRT-00643) Datasheet <https://cdn.sparkfun.com/datasheets/Prototyping/04908.pdf> It is used on this SparkFun product: SparkFun RJ45 Breakout <https://www.sparkfun.com/products/716> (BOB-00716) Note, you may also be interested in the "MAGJACK" version of this. It is basically a RJ45 connector, but also has some status LEDs built into the connector housing. You can check that out in this library at the device named "MAGJACK.dev" and see these products online: RJ45 Ethernet MagJack-Compatible <https://www.sparkfun.com/products/8534> (PRT-08534) SparkFun RJ45 MagJack Breakout <https://www.sparkfun.com/products/13021> (BOB-13021); PROD_ID: CONN-08506; SF_ID: PRT-00643
X5 X105 = SparkFun-Connectors:AUDIO_JACK_TRRS: Audio Jack - 3.5mm TRRS (SMD) This is a 3.5mm TRRS SMD audio jack. TRRS connectors are the audio-style connectors that you see on some phones, MP3 players and development boards. TRRS stands for “tip, ring, ring, sleeve,” which reflects that this has three conductors and a ground. SparkFun Products: Audio Jack <https://www.sparkfun.com/products/12639> mbed Starter Kit <https://www.sparkfun.com/products/12968> SparkFun TRRS 3.5mm Jack Breakout <https://www.sparkfun.com/products/11570>; PROD_ID: CONN-10676; SF_ID: PRT-12639
XR1-XR3 = varistor:THERMISTOR: THERMISTOR